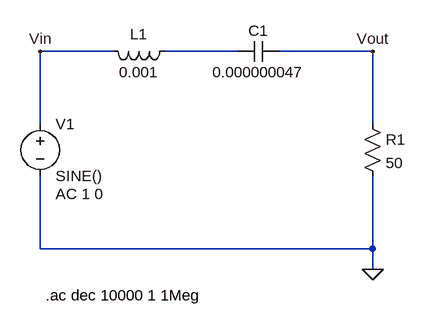
[diagram p0: schematic Pasa_Banda.asc]
Pasa_Banda.asc, the LTspice schematic file:
Version 4
SHEET 1 880 680
WIRE 112 -16 0 -16
WIRE 304 -16 192 -16
WIRE 512 -16 368 -16
WIRE 0 96 0 -16
WIRE 512 96 512 -16
WIRE 0 288 0 176
WIRE 512 288 512 176
WIRE 512 288 0 288
WIRE 512 320 512 288
FLAG 512 320 0
FLAG 0 -16 Vin
FLAG 512 -16 Vout
SYMBOL voltage 0 80 R0
WINDOW 123 24 124 Left 2
WINDOW 39 0 0 Left 0
SYMATTR InstName V1
SYMATTR Value SINE()
SYMATTR Value2 AC 1 0
SYMBOL ind 208 -32 R90
WINDOW 0 5 56 VBottom 2
WINDOW 3 32 56 VTop 2
SYMATTR InstName L1
SYMATTR Value 0.001
SYMBOL cap 368 -32 R90
WINDOW 0 0 32 VBottom 2
WINDOW 3 32 32 VTop 2
SYMATTR InstName C1
SYMATTR Value 0.000000047
SYMBOL res 496 80 R0
SYMATTR InstName R1
SYMATTR Value 50
TEXT 8 360 Left 2 !.ac dec 10000 1 1Meg

The netlist it stands for:
* Pasa_Banda.asc
V1 Vin 0 SINE() AC 1 0
L1 N001 Vin 0.001
C1 Vout N001 0.000000047
R1 Vout 0 50
.ac dec 10000 1 1Meg
.backanno
.end